# EAGLE schematic dozer.mover (EAGLE 6.4)
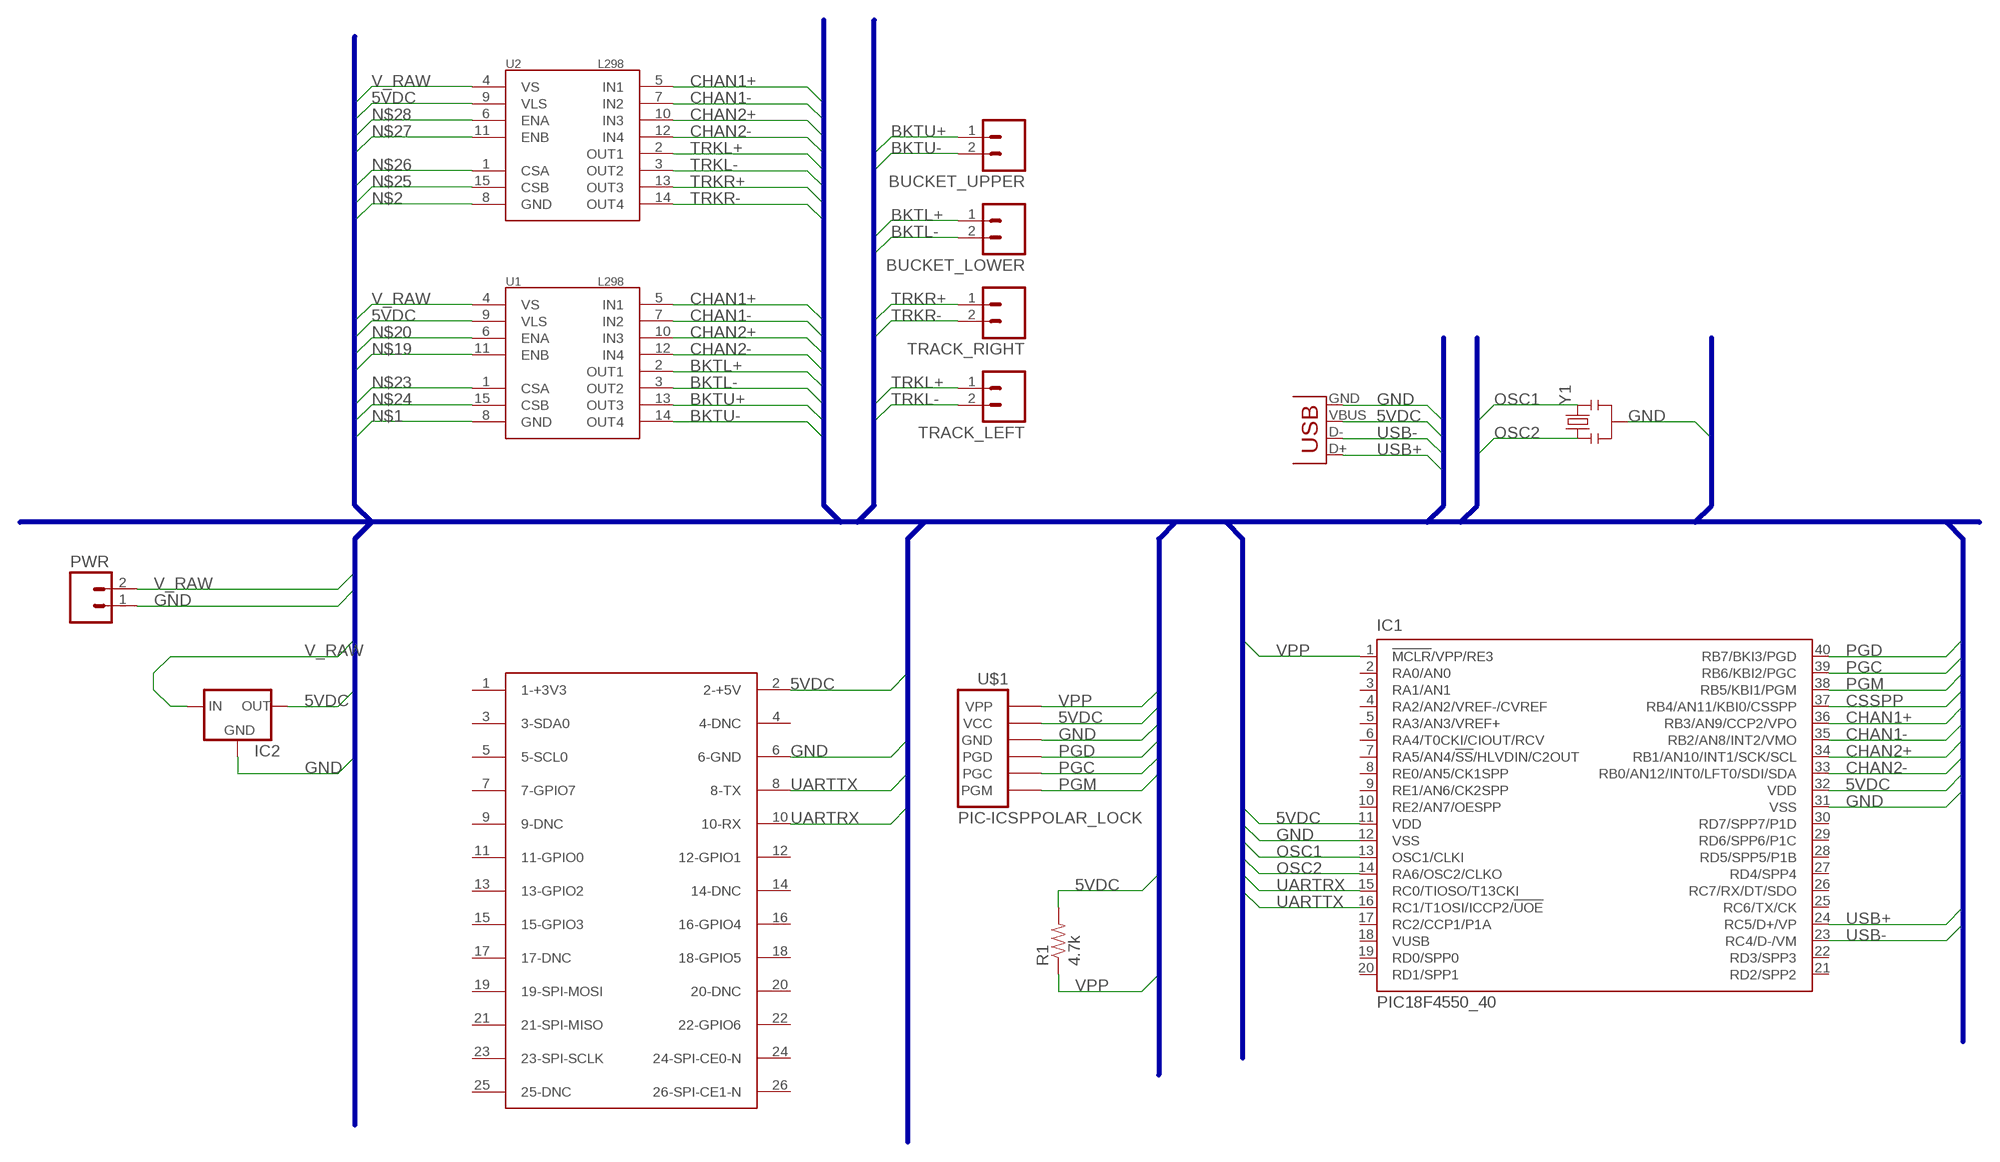
[diagram p0: schematic, sheet 1]

## Parts
BUCKET_LOWER  M02JST-PTH-2  [JST-2-PTH]
BUCKET_UPPER  M02JST-PTH-2  [JST-2-PTH]
IC1  PIC18F4550_40  [DIL40]
IC2  V_REG_78XXSINK  [TO220-IGO]
J1  RASPBERRY-PI  [RASPBERRY-PI]
JP1  USB-MB-H  [USB-MB-H]
PWR  M02JST-PTH-2  [JST-2-PTH]
R1  4.7k  RESISTORPTH-1/4W  [AXIAL-0.4]
TRACK_LEFT  M02JST-PTH-2  [JST-2-PTH]
TRACK_RIGHT  M02JST-PTH-2  [JST-2-PTH]
U1  L298  [MULTIWATT15]
U2  L298  [MULTIWATT15]
U$1  PIC-ICSPPOLAR_LOCK  [MOLEX-1X6_LOCK]
Y1  RESONATORPTH  [RESONATOR-PTH]

## Nets
5VDC: IC1.11(VDD) IC1.32(VDD) IC2.OUT J1.2(2-+5V) JP1.VBUS R1.P$2 U1.9(VLS) U2.9(VLS) U$1.5(VCC)
BKTL+: BUCKET_LOWER.1 U1.2(OUT1)
BKTL-: BUCKET_LOWER.2 U1.3(OUT2)
BKTU+: BUCKET_UPPER.1 U1.13(OUT3)
BKTU-: BUCKET_UPPER.2 U1.14(OUT4)
CHAN1+: IC1.36(RB3/AN9/CCP2/VPO) U1.5(IN1) U2.5(IN1)
CHAN1-: IC1.35(RB2/AN8/INT2/VMO) U1.7(IN2) U2.7(IN2)
CHAN2+: IC1.34(RB1/AN10/INT1/SCK/SCL) U1.10(IN3) U2.10(IN3)
CHAN2-: IC1.33(RB0/AN12/INT0/LFT0/SDI/SDA) U1.12(IN4) U2.12(IN4)
CSSPP: IC1.37(RB4/AN11/KBI0/CSSPP)
GND: IC1.12(VSS) IC1.31(VSS) IC2.GND J1.6(6-GND) JP1.GND PWR.1 U$1.4(GND) Y1.2
N$1: U1.8(GND)
N$2: U2.8(GND)
N$19: U1.11(ENB)
N$20: U1.6(ENA)
N$23: U1.1(CSA)
N$24: U1.15(CSB)
N$25: U2.15(CSB)
N$26: U2.1(CSA)
N$27: U2.11(ENB)
N$28: U2.6(ENA)
OSC1: IC1.13(OSC1/CLKI) Y1.3
OSC2: IC1.14(RA6/OSC2/CLKO) Y1.1
PGC: IC1.39(RB6/KBI2/PGC) U$1.2(PGC)
PGD: IC1.40(RB7/BKI3/PGD) U$1.3(PGD)
PGM: IC1.38(RB5/KBI1/PGM) U$1.1(PGM)
TRKL+: TRACK_LEFT.1 U2.2(OUT1)
TRKL-: TRACK_LEFT.2 U2.3(OUT2)
TRKR+: TRACK_RIGHT.1 U2.13(OUT3)
TRKR-: TRACK_RIGHT.2 U2.14(OUT4)
UARTRX: IC1.15(RC0/TIOSO/T13CKI) J1.10(10-RX)
UARTTX: IC1.16(RC1/T1OSI/ICCP2/!UOE) J1.8(8-TX)
USB+: IC1.24(RC5/D+/VP) JP1.D+
USB-: IC1.23(RC4/D-/VM) JP1.D-
V_RAW: IC2.IN PWR.2 U1.4(VS) U2.4(VS)
VPP: IC1.1(!MCLR!/VPP/RE3) R1.P$1 U$1.6(VPP)
Unconnected: IC1.2(RA0/AN0) IC1.3(RA1/AN1) IC1.4(RA2/AN2/VREF-/CVREF) IC1.5(RA3/AN3/VREF+) IC1.6(RA4/T0CKI/CIOUT/RCV) IC1.7(RA5/AN4/!SS!/HLVDIN/C2OUT) IC1.8(RE0/AN5/CK1SPP) IC1.9(RE1/AN6/CK2SPP) IC1.10(RE2/AN7/OESPP) IC1.17(RC2/CCP1/P1A) IC1.18(VUSB) IC1.19(RD0/SPP0) IC1.20(RD1/SPP1) IC1.21(RD2/SPP2) IC1.22(RD3/SPP3) IC1.25(RC6/TX/CK) IC1.26(RC7/RX/DT/SDO) IC1.27(RD4/SPP4) IC1.28(RD5/SPP5/P1B) IC1.29(RD6/SPP6/P1C) IC1.30(RD7/SPP7/P1D) J1.1(1-+3V3) J1.3(3-SDA0) J1.4(4-DNC) J1.5(5-SCL0) J1.7(7-GPIO7) J1.9(9-DNC) J1.11(11-GPIO0) J1.12(12-GPIO1) J1.13(13-GPIO2) J1.14(14-DNC) J1.15(15-GPIO3) J1.16(16-GPIO4) J1.17(17-DNC) J1.18(18-GPIO5) J1.19(19-SPI-MOSI) J1.20(20-DNC) J1.21(21-SPI-MISO) J1.22(22-GPIO6) J1.23(23-SPI-SCLK) J1.24(24-SPI-CE0-N) J1.25(25-DNC) J1.26(26-SPI-CE1-N)

## Buses
B$1

## Library data of the parts
BUCKET_LOWER BUCKET_UPPER PWR TRACK_LEFT TRACK_RIGHT = SparkFun-Connectors:M02: Header 2 Standard 2-pin 0.1" header. Use with straight break away headers (SKU : PRT-00116), right angle break away headers (PRT-00553), swiss pins (PRT-00743), machine pins (PRT-00117), and female headers (PRT-00115). Molex polarized connector foot print use with SKU : PRT-08233 with associated crimp pins and housings.
IC1 = microchip:PIC18F4*_40: USB Microcontrollers with nanoWatt Technology High-Performance, Enhanced Flash, 28/40/44-Pin, Source: http://ww1.microchip.com/downloads/en/devicedoc/39632c.pdf; MF: MICROCHIP; MPN: PIC18F4550-I/P; OC_FARNELL: 9321357; OC_NEWARK: 74K8623
IC2 = SparkFun-PowerIC:V_REG_78XX: Voltage Regulator Standard 7805 5V regulator. IGO (Input Ground Output). Spark Fun Electronics SKU : COM-00107
J1 = RaspberryPi:RASPBERRY-PI: Raspberry Pi Board <http://www.raspberrypi.org/> Jacques Lagnel V1.0 (beta) 2012 Board dimension: Forum 3D model <http://www.raspberrypi.org/forum/general-discussion/mechanical-profile-3d-models?value=3d%20model&type=1&include=1&search=1&ret=all> The GPIO Connector (P1): http://elinux.org/RPi_Low-level_peripherals
JP1 = SparkFun-Connectors:USB: USB Connectors USB-B-PTH is fully proven SKU : PRT-00139/CONN-08278 USB-miniB is fully proven SKU : PRT-00587 USB-A-PCB is untested. USB-A-H is throughly reviewed, but untested. Spark Fun Electronics SKU : PRT-00437 USB-B-SMT is throughly reviewed, but untested. Needs silkscreen touching up. USB-A-S has not been used/tested USB-MB-H has not been used/tested USB-MICROB has been used. CONN-09505
R1 = SparkFun-Resistors:RESISTOR: Resistor Basic schematic elements and footprints for 0603, 1206, and PTH resistors.
U1 U2 = SparkFun-PowerIC:L298: L298 Dual Full Bridge Driver
U$1 = SparkFun-Connectors:PIC-ICSP: ISCP Programming connector for UAV, UBW Kit, etc.
Y1 = SparkFun-FreqCtrl:RESONATOR: Resonator Small SMD resonator. Used, eg, on the Arduino Pro/ Pro Mini boards. 8MHz- XTAL-08895 16MHz- XTAL-08900